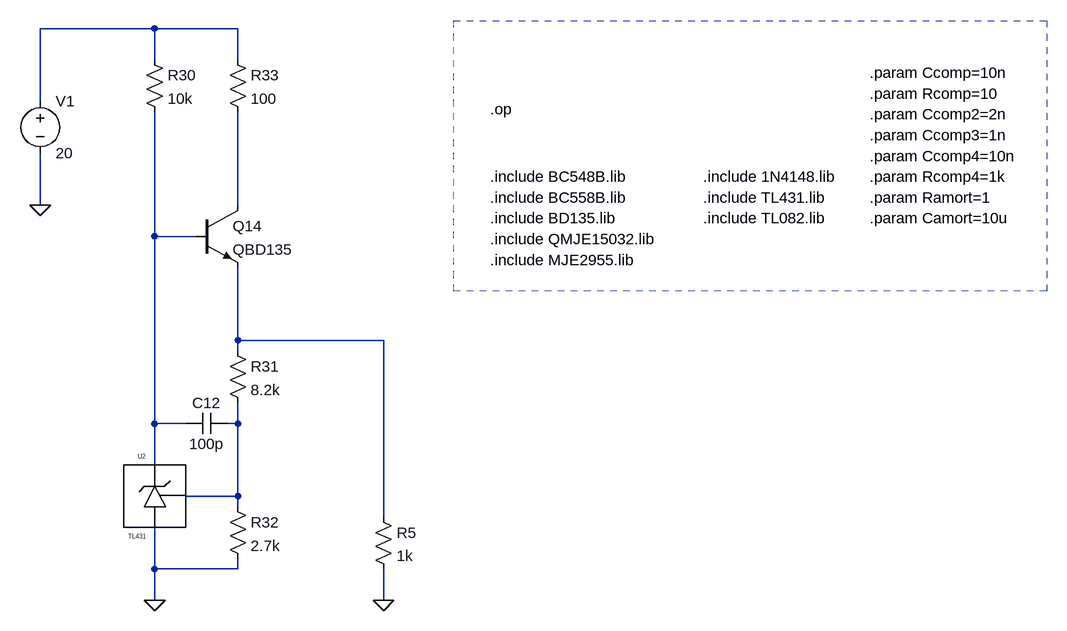
[diagram p0: schematic power_supply_P04.0.asc]
power_supply_P04.0.asc, the LTspice schematic file:
Version 4
SHEET 1 3040 1240
WIRE -1328 -752 -1504 -752
WIRE -1200 -752 -1328 -752
WIRE -1328 -704 -1328 -752
WIRE -1200 -704 -1200 -752
WIRE -1504 -640 -1504 -752
WIRE -1200 -544 -1200 -624
WIRE -1504 -480 -1504 -560
WIRE -1200 -480 -1200 -544
WIRE -1328 -432 -1328 -624
WIRE -1264 -432 -1328 -432
WIRE -1200 -304 -1200 -384
WIRE -1200 -272 -1200 -304
WIRE -976 -272 -1200 -272
WIRE -1200 -256 -1200 -272
WIRE -1328 -224 -1328 -432
WIRE -1328 -144 -1328 -224
WIRE -1280 -144 -1328 -144
WIRE -1200 -144 -1200 -176
WIRE -1200 -144 -1216 -144
WIRE -1328 -80 -1328 -144
WIRE -1200 -32 -1200 -144
WIRE -1200 -32 -1280 -32
WIRE -1200 -16 -1200 -32
WIRE -976 0 -976 -272
WIRE -1328 80 -1328 16
WIRE -1200 80 -1200 64
WIRE -1200 80 -1328 80
WIRE -1328 128 -1328 80
WIRE -976 128 -976 80
FLAG -976 128 0
FLAG -1328 128 0
FLAG -1504 -480 0
DATAFLAG -1328 -432 ""
DATAFLAG -1200 -544 ""
DATAFLAG -1200 -304 "-Ie(Q14)"
DATAFLAG -1328 -224 "Ix(U2:CATHODE)"
SYMBOL voltage -1504 -656 R0
SYMATTR InstName V1
SYMATTR Value 20
SYMBOL res -992 -16 R0
SYMATTR InstName R5
SYMATTR Value 1k
SYMBOL res -1344 -720 R0
SYMATTR InstName R30
SYMATTR Value 10k
SYMBOL npn -1264 -480 R0
SYMATTR InstName Q14
SYMATTR Value QBD135
SYMBOL res -1216 -272 R0
SYMATTR InstName R31
SYMATTR Value 8.2k
SYMBOL res -1216 -32 R0
SYMATTR InstName R32
SYMATTR Value 2.7k
SYMBOL cap -1216 -160 R90
WINDOW 0 0 32 VBottom 2
WINDOW 3 32 32 VTop 2
SYMATTR InstName C12
SYMATTR Value 100p
SYMBOL TL431 -1328 -32 M0
SYMATTR InstName U2
SYMBOL res -1216 -720 R0
SYMATTR InstName R33
SYMATTR Value 100
TEXT -812 -492 Left 2 !.include BC558B.lib
TEXT -484 -460 Left 2 !.include TL082.lib
TEXT -812 -524 Left 2 !.include BC548B.lib
TEXT -812 -396 Left 2 !.include MJE2955.lib
TEXT -812 -460 Left 2 !.include BD135.lib
TEXT -484 -524 Left 2 !.include 1N4148.lib
TEXT -484 -492 Left 2 !.include TL431.lib
TEXT -812 -428 Left 2 !.include QMJE15032.lib
TEXT -812 -628 Left 2 !.op
TEXT -228 -684 Left 2 !.param Ccomp=10n
TEXT -228 -652 Left 2 !.param Rcomp=10
TEXT -228 -620 Left 2 !.param Ccomp2=2n
TEXT -228 -588 Left 2 !.param Ccomp3=1n
TEXT -228 -556 Left 2 !.param Ccomp4=10n
TEXT -228 -492 Left 2 !.param Ramort=1
TEXT -228 -460 Left 2 !.param Camort=10u
TEXT -228 -524 Left 2 !.param Rcomp4=1k
RECTANGLE Normal 44 -348 -868 -764 1

The netlist it stands for:
* power_supply_P04.0.asc
V1 N001 0 20
R5 N004 0 1k
R30 N001 N003 10k
Q14 N002 N003 N004 0 QBD135
R31 N004 N005 8.2k
R32 N005 0 2.7k
C12 N005 N003 100p
XU2 N003 0 N005 TL431  ; pins CATHODE ANODE REF
R33 N001 N002 100
.model NPN NPN
.model PNP PNP
.lib standard.bjt
.include BC558B.lib
.include TL082.lib
.include BC548B.lib
.include MJE2955.lib
.include BD135.lib
.include 1N4148.lib
.include TL431.lib
.include QMJE15032.lib
.op
.param Ccomp=10n
.param Rcomp=10
.param Ccomp2=2n
.param Ccomp3=1n
.param Ccomp4=10n
.param Ramort=1
.param Camort=10u
.param Rcomp4=1k
.lib tl431.lib
.backanno
.end